# Altium schematic sheet CC2530.SchDoc
size A4
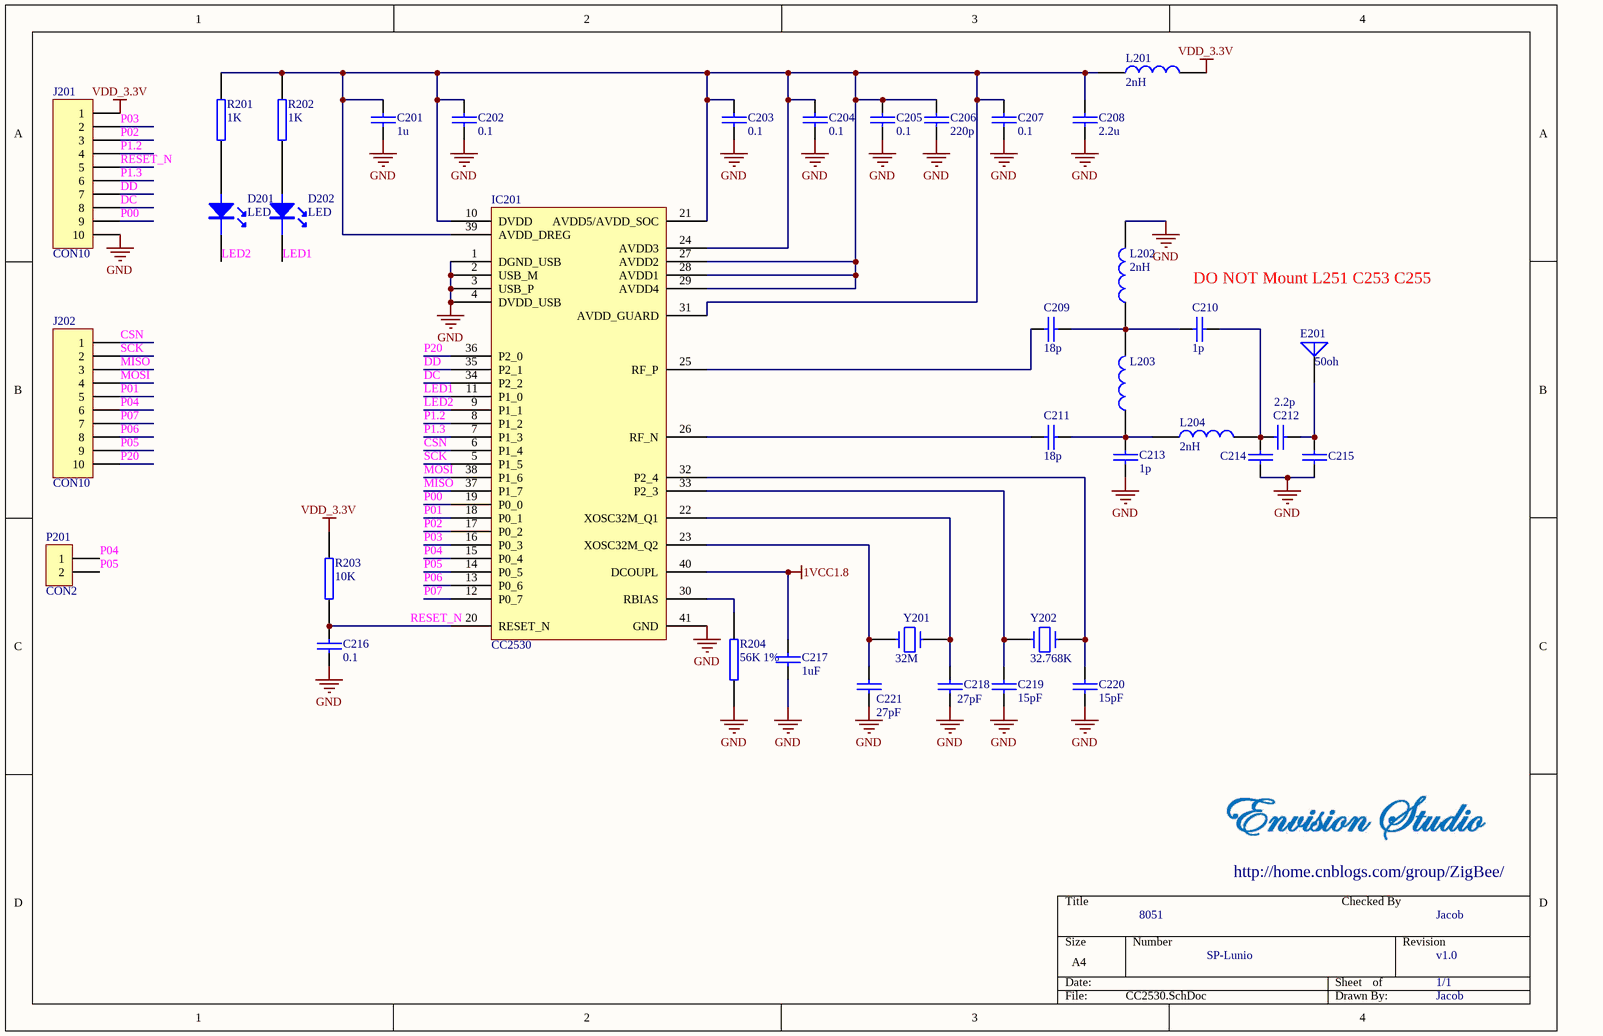
[diagram p0: CC2530.SchDoc]

## Parts
C201  1u  [0402]
C202  0.1  [0402]
C203  0.1  [0402]
C204  0.1  [0402]
C205  0.1  [0402]
C206  220p  [0402]
C207  0.1  [0402]
C208  2.2u  [0402]
C209  18p  [0402]
C210  1p  [0402]
C211  18p  [0402]
C212  2.2p  [0402]
C213  1p  [0402]
C214  (no value)  [0402]
C215  (no value)  [0402]
C216  0.1  [0402]
C217  1uF  [0402]
C218  27pF  [0402]
C219  15pF  [0402]
C220  15pF  [0402]
C221  27pF  [0402]
D201  LED  [LED-0603]
D202  LED  [LED-0603]
E201  50oh  [ANT]
IC201  CC2530  [PVQFN-N40]
J201  CON10  [SIP10-2.0]
J202  CON10  [SIP10-2.0]
L201  2nH  [0402]
L202  2nH  [0402]
L203  (no value)  [0402]
L204  2nH  [0402]
P201  CON2  [SIP2]
R201  1K  [0402]
R202  1K  [0402]
R203  10K  [0402]
R204  56K 1%  [0402]
Y201  32M  [XT-SMD3225]
Y202  32.768K  [XT_3]

## Nets
1VCC1.8: C217.1 IC201.40(DCOUPL)
GND: C201.2 C202.2 C203.2 C204.2 C205.2 C206.2 C207.2 C208.2 C213.2 C214.2 C215.1 C216.2 C217.2 C218.2 C219.2 C220.2 C221.2 IC201.1(DGND_USB) IC201.2(USB_M) IC201.3(USB_P) IC201.4(DVDD_USB) IC201.41(GND) J201.10 L202.2 R204.2
VDD_3.3V: J201.1 L201.2 R203.2
CSN: IC201.6(P1_4) J202.1
DC: IC201.34(P2_2) J201.8
DD: IC201.35(P2_1) J201.7
LED1: D202.K IC201.11(P1_0)
LED2: D201.K IC201.9(P1_1)
MISO: IC201.37(P1_7) J202.3
MOSI: IC201.38(P1_6) J202.4
P00: IC201.19(P0_0) J201.9
P01: IC201.18(P0_1) J202.5
P1.2: IC201.8(P1_2) J201.4
P1.3: IC201.7(P1_3) J201.6
P02: IC201.17(P0_2) J201.3
P03: IC201.16(P0_3) J201.2
P04: IC201.15(P0_4) J202.6 P201.1
P05: IC201.14(P0_5) J202.9 P201.2
P06: IC201.13(P0_6) J202.8
P07: IC201.12(P0_7) J202.7
P20: IC201.36(P2_0) J202.10
RESET_N: C216.1 IC201.20(RESET_N) J201.5 R203.1
SCK: IC201.5(P1_5) J202.2
NetC201_1: C201.1 C202.1 C203.1 C204.1 C205.1 C206.1 C207.1 C208.1 IC201.10(DVDD) IC201.21(AVDD5/AVDD_SOC) IC201.24(AVDD3) IC201.27(AVDD2) IC201.28(AVDD1) IC201.29(AVDD4) IC201.31(AVDD_GUARD) IC201.39(AVDD_DREG) L201.1 R201.2 R202.2
NetC209_1: C209.1 IC201.25(RF_P)
NetC209_2: C209.2 C210.1 L202.1 L203.2
NetC210_2: C210.2 C212.1 C214.1 L204.2
NetC211_1: C211.1 IC201.26(RF_N)
NetC211_2: C211.2 C213.1 L203.1 L204.1
NetC212_2: C212.2 C215.2 E201.1(A)
NetC218_1: C218.1 IC201.22(XOSC32M_Q1) Y201.2
NetC219_1: C219.1 IC201.33(P2_3) Y202.2
NetC220_1: C220.1 IC201.32(P2_4) Y202.1
NetC221_1: C221.1 IC201.23(XOSC32M_Q2) Y201.1
NetD201_A: D201.A R201.1
NetD202_A: D202.A R202.1
NetIC201_30: IC201.30(RBIAS) R204.1

## Notes on the sheet
- (near C210) DO NOT Mount L251 C253 C255
- 8051
- http://home.cnblogs.com/group/ZigBee/
- Checked By
- Jacob
- SP-Lunio
- v1.0
- 1/1

## Library data of the parts
C201-C221 = CAP: Capacitor
E201 = ANTENNA: Generic Antenna
IC201 = CC2
J201 J202 = CON10: Connector
L201-L204 = INDUCTOR
P201 = CON2: Connector
R201-R204 = RES2
Y201 Y202 = CRYSTAL